# Altium project lan_control.PrjPCB
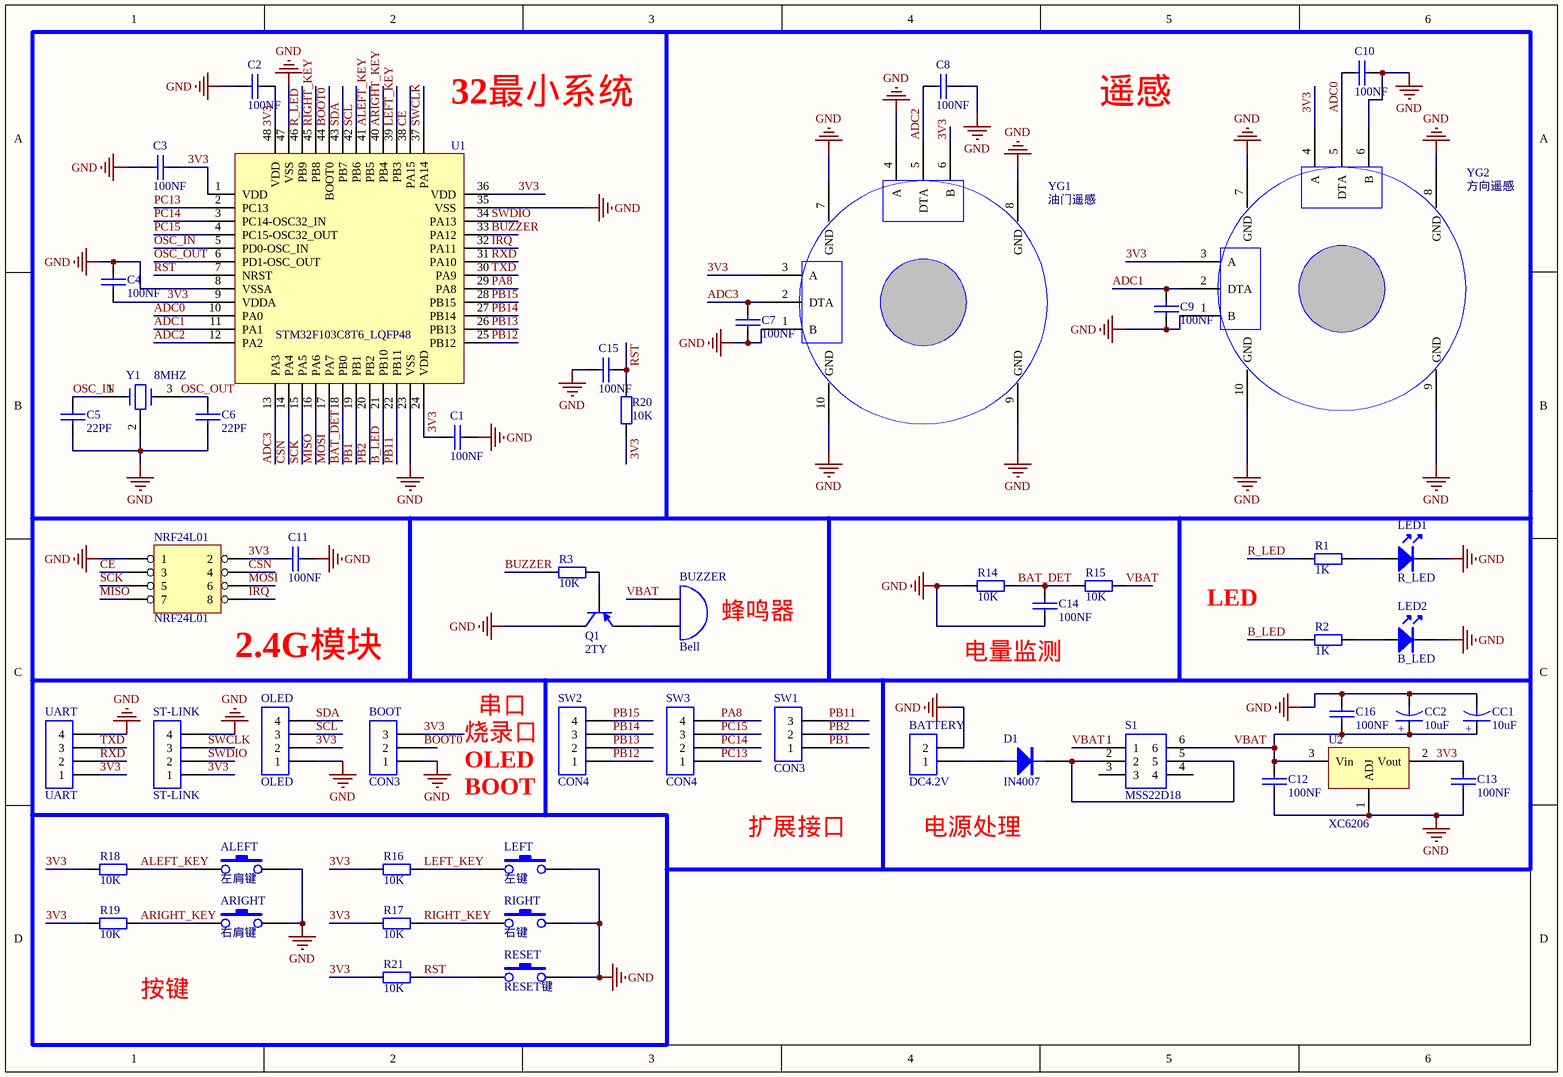
[diagram p0: lan_control.SchDoc]
1 sheet, 54 parts. Net scope: global (net labels, ports and power ports of the same name join across sheets).
Board file: lan_control.PcbDoc

## Sheet lan_control.SchDoc
size 292 x 200 mm

### Parts
ALEFT  左肩键  [FWAL]
ARIGHT  右肩键  [FWAL]
BATTERY  DC4.2V  [SIP2]
BOOT  CON3  [SIP3]
BUZZER  Bell  [蜂鸣器BUZZER-D12]
C1  100NF  [C_0603]
C2  100NF  [C_0603]
C3  100NF  [C_0603]
C4  100NF  [C_0603]
C5  22PF  [C_0603]
C6  22PF  [C_0603]
C7  100NF  [C_0603]
C8  100NF  [C_0603]
C9  100NF  [C_0603]
C10  100NF  [C_0603]
C11  100NF  [C_0603]
C12  100NF  [C_0603]
C13  100NF  [C_0603]
C14  100NF  [C_0603]
C15  100NF  [C_0603]
C16  100NF  [C_0603]
CC1  10uF  [C_1206]
CC2  10uF  [C_1206]
D1  IN4007  [SOD-123]
LED1  R_LED  [LED0603]
LED2  B_LED  [LED0603]
LEFT  左键  [KEYSW-6X6]
NRF24L01  NRF24L01  [24L01]
OLED  OLED  [SIP4]
Q1  2TY  [SOT23-213]
R1  1K  [R0603]
R2  1K  [R0603]
R3  10K  [R0603]
R14  10K  [R0603]
R15  10K  [R0603]
R16  10K  [R0603]
R17  10K  [R0603]
R18  10K  [R0603]
R19  10K  [R0603]
R20  10K  [R0603]
R21  10K  [R0603]
RESET  RESET键  [KEYSW-6X6]
RIGHT  右键  [KEYSW-6X6]
S1  MSS22D18  [MSS22D18]
ST-LINK  ST-LINK  [SIP4]
SW1  CON3  [SIP3]
SW2  CON4  [SIP4]
SW3  CON4  [SIP4]
U1  STM32F103C8T6_LQFP48  [LQFP48_STM32]
U2  XC6206  [SOT23-PIN132]
UART  UART  [SIP4]
Y1  8MHZ  [Y3213]
YG1  油门遥感  [GY]
YG2  方向遥感  [GY]

### Nets
GND: ALEFT.4 ARIGHT.4 BATTERY.2 BOOT.1 C1.2 C2.1 C3.1 C4.1 C5.2 C6.1 C7.2 C8.2 C9.2 C10.1 C11.2 C12.2 C13.2 C14.1 C15.1 C16.2 CC1.2 CC2.2 LED1.2 LED2.2 LEFT.2 NRF24L01.1 OLED.1 Q1.1(C) R14.2 RESET.2 RIGHT.2 ST-LINK.4 U1.8(VSSA) U1.23(VSS) U1.35(VSS) U1.47(VSS) U2.1(ADJ) UART.4 Y1.2 YG1.1(B) YG1.4(A) YG1.7(GND) YG1.8(GND) YG1.9(GND) YG1.10(GND) YG2.1(B) YG2.6(B) YG2.7(GND) YG2.8(GND) YG2.9(GND) YG2.10(GND)
3V3: BOOT.3 C1.1 C2.2 C3.2 C4.2 C11.1 C13.1 NRF24L01.2 OLED.2 R16.2 R17.2 R18.2 R19.2 R20.1 R21.2 ST-LINK.1 U1.1(VDD) U1.9(VDDA) U1.24(VDD) U1.36(VDD) U1.48(VDD) U2.2(Vout) UART.1 YG1.3(A) YG1.6(B) YG2.3(A) YG2.4(A)
ADC0: C10.2 U1.10(PA0) YG2.5(DTA)
ADC1: C9.1 U1.11(PA1) YG2.2(DTA)
ADC2: C8.1 U1.12(PA2) YG1.5(DTA)
ADC3: C7.1 U1.13(PA3) YG1.2(DTA)
ALEFT_KEY: ALEFT.3 R18.1 U1.41(PB5)
ARIGHT_KEY: ARIGHT.3 R19.1 U1.40(PB4)
B_LED: R2.1 U1.21(PB10)
BAT_DET: C14.2 R14.1 R15.1 U1.18(PB0)
BOOT0: BOOT.2 U1.44(BOOT0)
BUZZER: R3.1 U1.33(PA12)
CE: NRF24L01.3 U1.38(PA15)
CSN: NRF24L01.4 U1.14(PA4)
IRQ: NRF24L01.8 U1.32(PA11)
LEFT_KEY: LEFT.1 R16.1 U1.39(PB3)
MISO: NRF24L01.7 U1.16(PA6)
MOSI: NRF24L01.6 U1.17(PA7)
OSC_IN: C5.1 U1.5(PD0-OSC_IN) Y1.1
OSC_OUT: C6.2 U1.6(PD1-OSC_OUT) Y1.3
PA8: SW3.4 U1.29(PA8)
PB1: SW1.1 U1.19(PB1)
PB2: SW1.2 U1.20(PB2)
PB11: SW1.3 U1.22(PB11)
PB12: SW2.1 U1.25(PB12)
PB13: SW2.2 U1.26(PB13)
PB14: SW2.3 U1.27(PB14)
PB15: SW2.4 U1.28(PB15)
PC13: SW3.1 U1.2(PC13)
PC14: SW3.2 U1.3(PC14-OSC32_IN)
PC15: SW3.3 U1.4(PC15-OSC32_OUT)
R_LED: R1.1 U1.46(PB9)
RIGHT_KEY: R17.1 RIGHT.1 U1.45(PB8)
RST: C15.2 R20.2 R21.1 RESET.1 U1.7(NRST)
RXD: U1.31(PA10) UART.2
SCK: NRF24L01.5 U1.15(PA5)
SCL: OLED.3 U1.42(PB6)
SDA: OLED.4 U1.43(PB7)
SWCLK: ST-LINK.3 U1.37(PA14)
SWDIO: ST-LINK.2 U1.34(PA13)
TXD: U1.30(PA9) UART.3
VBAT: BUZZER.1(A) C12.1 C16.1 CC1.1 CC2.1 R15.2 S1.1 S1.6 U2.3(Vin)
NetBATTERY_1: BATTERY.1 D1.1(A)
NetBUZZER_2: BUZZER.2(B) Q1.3(E)
NetD1_2: D1.2(K) S1.2 S1.5
NetLED1_1: LED1.1 R1.2
NetLED2_1: LED2.1 R2.2
NetQ1_2: Q1.2(B) R3.2

Not connected (* = marked no-connect by the designer): S1 3 4

### Notes on the sheet
- (near U1) 32最小系统
- 遥感
- (near BUZZER) 蜂鸣器
- LED
- (near NRF24L01) 2.4G模块
- 电量监测
- 烧录口
- 串口
- OLED
- BOOT
- 扩展接口
- 电源处理
- 按键
- (in symbol CAPACITOR POL) +

### Library data of the parts
ALEFT ARIGHT = SW-PB: 90度按键
BATTERY = CON2: Connector
BOOT SW1 = CON3: 排针
BUZZER = Bell: Electrical Bell; Published: 24-Mar-1999; LatestRevisionDate: 17-Jul-2002; LatestRevisionNote: Re-released for DXP Platform.; PackageReference: PIN2; Publisher: Altium Limited
C1-C16 = CAP: 0603贴片电容
CC1 CC2 = CAPACITOR POL: 3216贴片钽电容
D1 = DIODE
LED1 = LED: 红色LED
LED2 = LED: 蓝色LED
LEFT RESET RIGHT = SW: 180度按键
NRF24L01 = HEADER 4X2: 2.4G模块
OLED = CON4: 四针IIC协议OLED屏幕（GND开头）
Q1 = PNP: PNP三极管; Published: 8-Jun-2000; LatestRevisionDate: 29-May-2009; LatestRevisionNote: IPC-7351 Footprint Added.; PackageVersion: Aug-1999; PackageReference: SOT-23B; Publisher: Altium Limited; PackageDescription: 3-Pin SOT-23 Package 0.95 mm Pitch, 2.4 mm Lead Span
R1-R3 R14-R21 = Res2: 0603贴片电阻; Published: 8-Jun-2000; LatestRevisionDate: 17-Jul-2002; LatestRevisionNote: Re-released for DXP Platform.; Publisher: Altium Limited
  R1 R2: Value: 1K
  R3 R14-R21: Value: 10K
S1 = SW2X3: 开关
ST-LINK SW2 SW3 UART = CON4: 排针
U1 = STM32_LQFP48
U2 = LM317: 稳压LDO
Y1 = Y: 8MHZ贴片晶振
YG1 = YG: 10K左右回中上下不回中遥感电位器
YG2 = YG: 10K上下左右回中遥感电位器